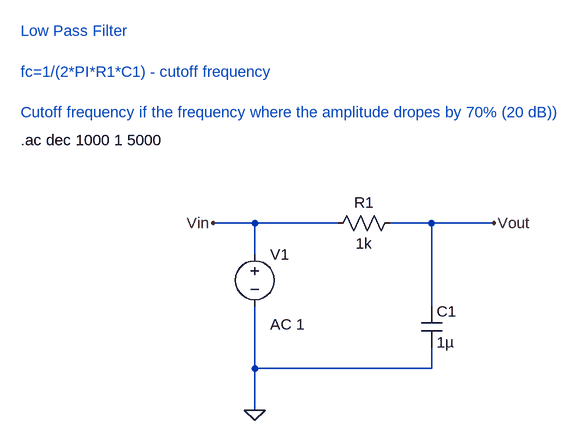
[diagram p0: schematic filter_low_pass.asc]
filter_low_pass.asc, the LTspice schematic file:
Version 4
SHEET 1 880 680
WIRE 16 0 -48 0
WIRE 144 0 16 0
WIRE 288 0 224 0
WIRE 384 0 288 0
WIRE 16 48 16 0
WIRE 288 128 288 0
WIRE 16 224 16 128
WIRE 288 224 288 192
WIRE 288 224 16 224
WIRE 16 288 16 224
FLAG 16 288 0
FLAG -48 0 Vin
FLAG 384 0 Vout
SYMBOL voltage 16 32 R0
WINDOW 123 24 124 Left 2
WINDOW 39 0 0 Left 0
SYMATTR Value2 AC 1
SYMATTR InstName V1
SYMATTR Value ""
SYMBOL cap 272 128 R0
SYMATTR InstName C1
SYMATTR Value 1µ
SYMBOL res 240 -16 R90
WINDOW 0 0 56 VBottom 2
WINDOW 3 32 56 VTop 2
SYMATTR InstName R1
SYMATTR Value 1k
TEXT -344 -128 Left 2 !.ac dec 1000 1 5000
TEXT -344 -296 Left 2 ;Low Pass Filter\n \nfc=1/(2*PI*R1*C1) - cutoff frequency\n \nCutoff frequency if the frequency where the amplitude dropes by 70% (20 dB))

The netlist it stands for:
* filter_low_pass.asc
V1 Vin 0 AC 1
C1 Vout 0 1µ
R1 Vout Vin 1k
.ac dec 1000 1 5000
* Low Pass Filter
* fc=1/(2*PI*R1*C1) - cutoff frequency
* Cutoff frequency if the frequency where the amplitude dropes by 70% (20 dB))
.backanno
.end